# EAGLE design captester (EAGLE 5.06)
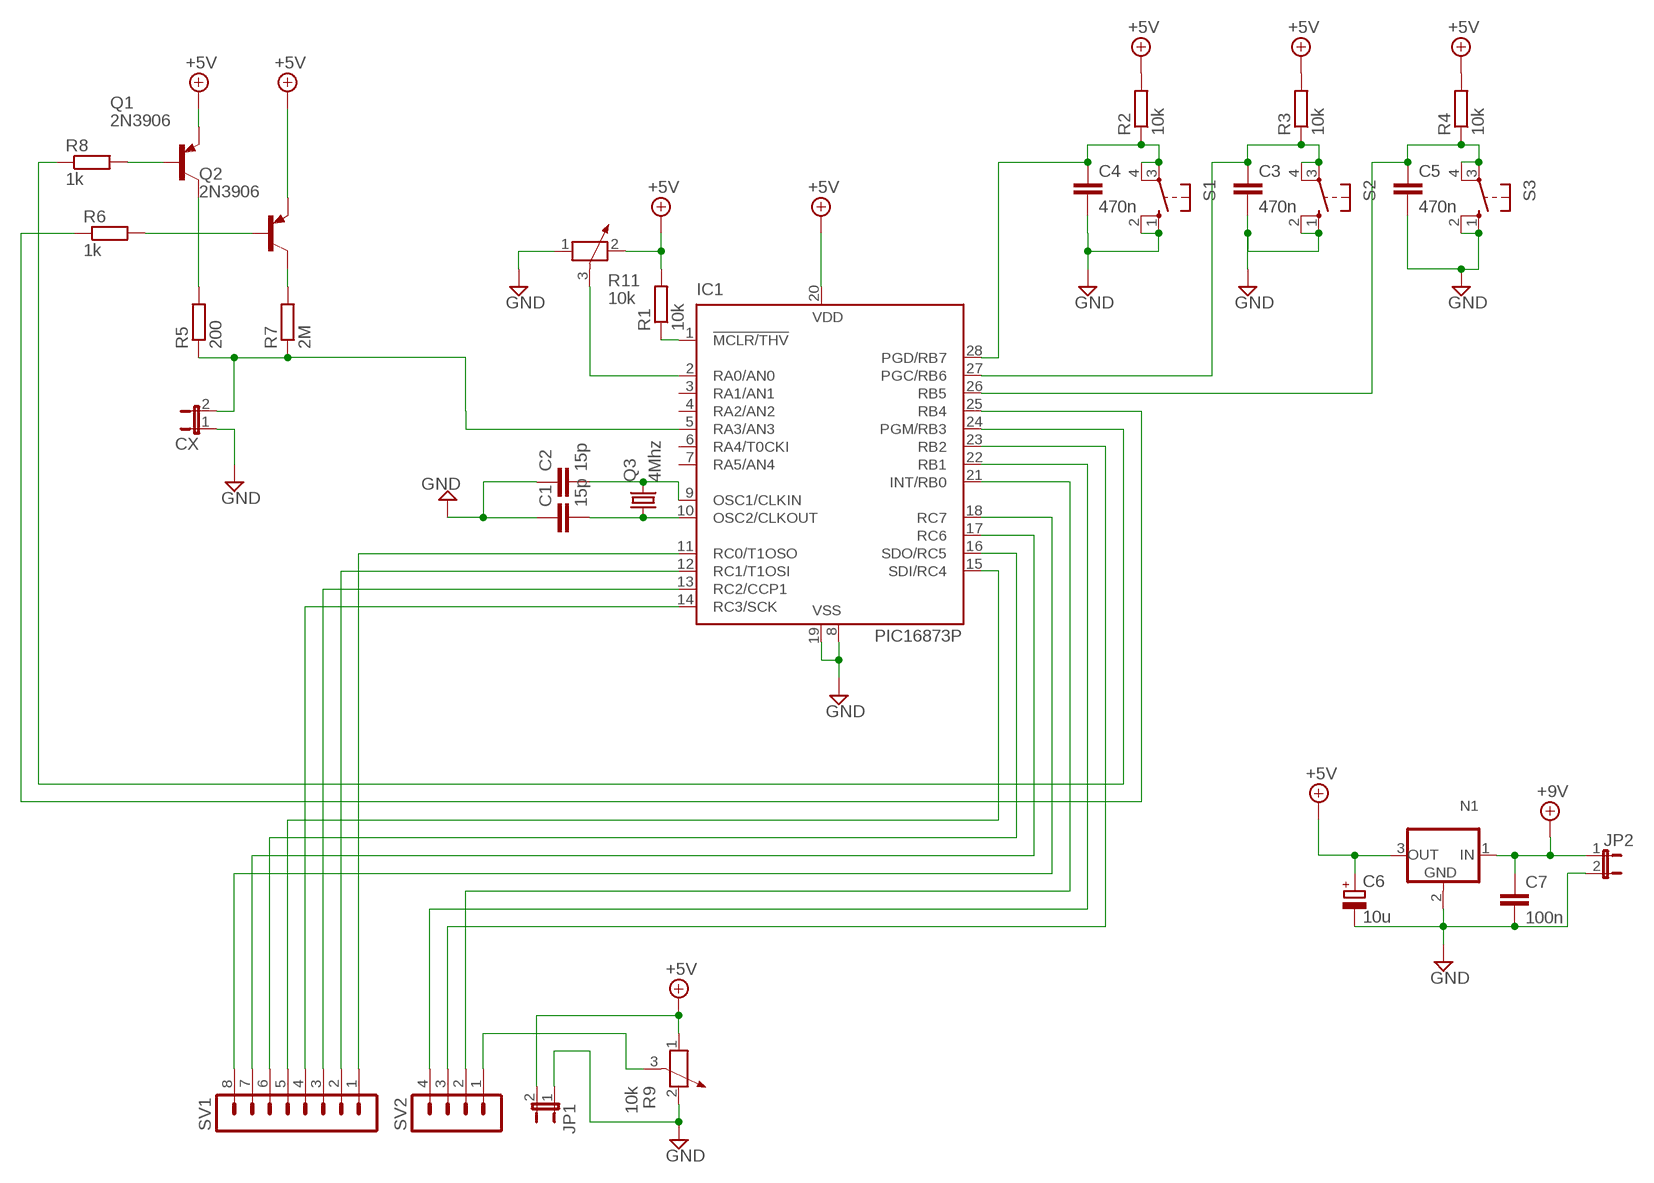
[diagram p0: schematic, sheet 1]

## Parts
C1  15p  C-EU025_050-025X075  [C025_050-025X075]
C2  15p  C-EU025_050-025X075  [C025_050-025X075]
C3  470n  C-EU025-025X050  [C025-025X050]
C4  470n  C-EU025-025X050  [C025-025X050]
C5  470n  C-EU025-025X050  [C025-025X050]
C6  10u  CPOL-EUE2.5-6  [E2,5-6]
C7  100n  C-EU025-025X050  [C025-025X050]
CX  JP1E  [JP1]
IC1  PIC16873P  [DIL28-3]
JP1  JP1E  [JP1]
JP2  JP1E  [JP1]
N1  7805  [TO220N]
Q1  2N3906  [TO92]
Q2  2N3906  [TO92]
Q3  4Mhz  CRYSTALHC49S  [HC49/S]
R1  10k  R-EU_0207/2V  [0207/2V]
R2  10k  R-EU_0207/2V  [0207/2V]
R3  10k  R-EU_0207/5V  [0207/5V]
R4  10k  R-EU_0207/2V  [0207/2V]
R5  200  R-EU_0207/2V  [0207/2V]
R6  1k  R-EU_0204/7  [0204/7]
R7  2M  R-EU_0207/2V  [0207/2V]
R8  1k  R-EU_0204/7  [0204/7]
R9  10k  POTENTIOMETER_PT-10S  [PT-10S]
R11  10k  POTENTIOMETER_PT-10S  [PT-10S]
S1  10-XX  [B3F-10XX]
S2  10-XX  [B3F-10XX]
S3  10-XX  [B3F-10XX]
SV1  MA08-1  [MA08-1]
SV2  MA04-1  [MA04-1]

## Nets
+5V: C6.+ IC1.20(VDD) JP1.2 N1.3(OUT) Q1.3(E) Q2.3(E) R1.2 R2.2 R3.2 R4.2 R9.1 R11.2
+9V: C7.1 JP2.1 N1.1(IN)
GND: C1.1 C2.1 C3.2 C4.2 C5.2 C6.- C7.2 CX.1 IC1.8(VSS) IC1.19(VSS) JP1.1 JP2.2 N1.2(GND) R9.2 R11.1 S1.1(S) S1.2(S1) S2.1(S) S2.2(S1) S3.1(S) S3.2(S1)
N$1: C4.1 IC1.28(PGD/RB7) R2.1 S1.3(P) S1.4(P1)
N$2: C3.1 IC1.27(PGC/RB6) R3.1 S2.3(P) S2.4(P1)
N$3: IC1.1(!MCLR/THV) R1.1
N$4: IC1.2(RA0/AN0) R11.3
N$5: C5.1 IC1.26(RB5) R4.1 S3.3(P) S3.4(P1)
N$6: R9.3 SV2.1
N$7: C2.2 IC1.9(OSC1/CLKIN) Q3.2
N$8: C1.2 IC1.10(OSC2/CLKOUT) Q3.1
N$9: Q2.2(B) R6.2
N$10: Q1.2(B) R8.2
N$11: Q2.1(C) R7.2
N$12: Q1.1(C) R5.2
N$13: CX.2 IC1.5(RA3/AN3) R5.1 R7.1
N$14: IC1.11(RC0/T1OSO) SV1.1
N$15: IC1.12(RC1/T1OSI) SV1.2
N$16: IC1.13(RC2/CCP1) SV1.3
N$17: IC1.14(RC3/SCK) SV1.4
N$18: IC1.15(SDI/RC4) SV1.5
N$19: IC1.16(SDO/RC5) SV1.6
N$20: IC1.17(RC6) SV1.7
N$21: IC1.18(RC7) SV1.8
N$22: IC1.21(INT/RB0) SV2.2
N$23: IC1.22(RB1) SV2.4
N$24: IC1.23(RB2) SV2.3
N$25: IC1.25(RB4) R6.1
N$26: IC1.24(PGM/RB3) R8.1
Unconnected: IC1.3(RA1/AN1) IC1.4(RA2/AN2) IC1.6(RA4/T0CKI) IC1.7(RA5/AN4)

## Library data of the parts
C1-C5 C7 = rcl:C-EU: CAPACITOR, European symbol
C6 = rcl:CPOL-EU: POLARIZED CAPACITOR, European symbol
CX JP1 JP2 = jumper:JP1E: JUMPER
IC1 = microchip:PIC16*873: MICROCONTROLLER flash type
N1 = ic:78*: 78xx: Fixed positive voltage regulator Voltage can be selected with change technology
Q1 Q2 = transistor-pnp:2N3906: PNP Transistor
Q3 = crystal:CRYSTAL: CRYSTAL
R1-R8 = rcl:R-EU_: RESISTOR, European symbol
R9 R11 = rcl:POTENTIOMETER_: Potentiometer
S1-S3 = switch-omron:10-XX: OMRON SWITCH
SV1 = con-lstb:MA08-1: PIN HEADER
SV2 = con-lstb:MA04-1: PIN HEADER

## Board
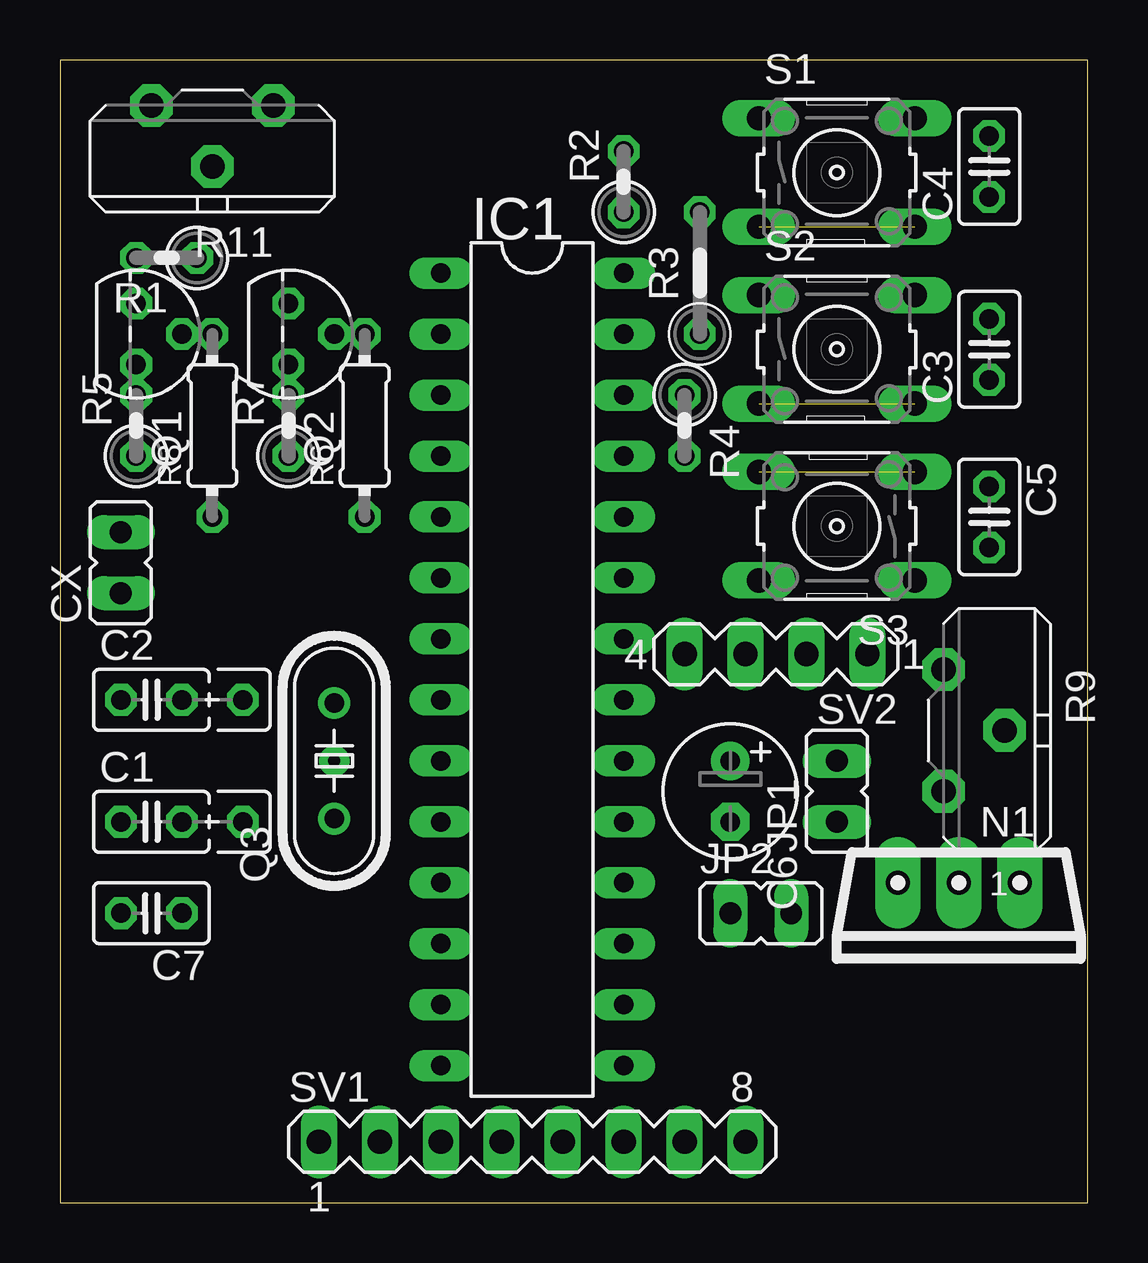
[diagram p1: board, top side]
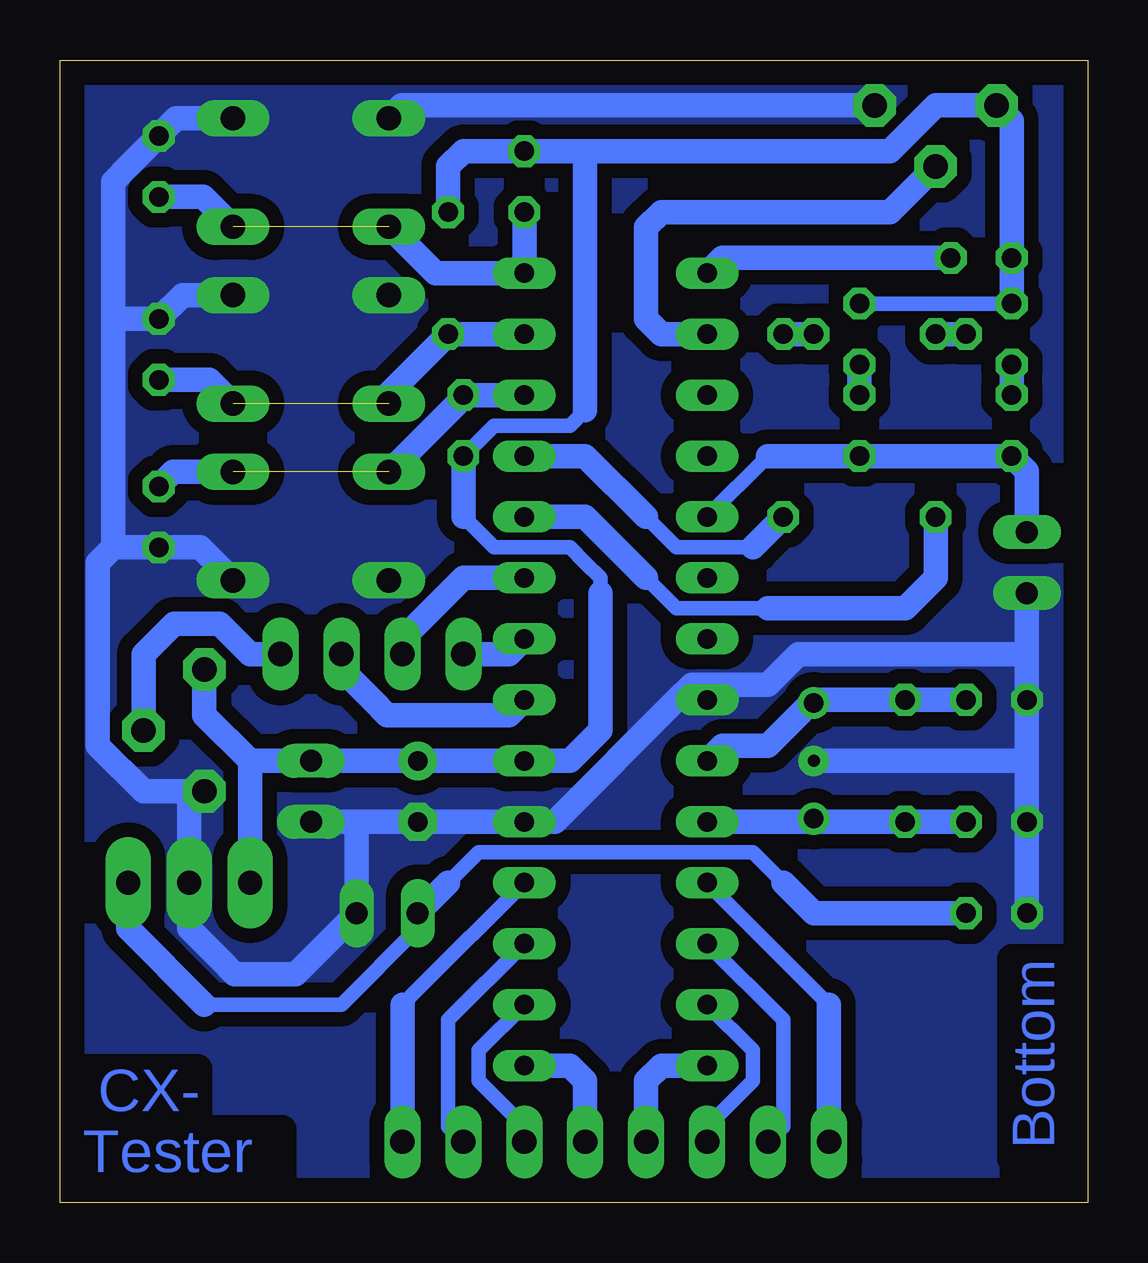
[diagram p2: board, bottom side, seen from below]

Size 42.85 x 47.62 mm. Coordinates in mm from the lower left corner, seen from the top.
Outline: 0,0 42.85,0 42.85,47.62 0,47.62 0,0
Copper layers (1*16): Top 0.035mm / dielectric 1.5mm / Bottom 0.035mm
Design rules "default": minimum track width 10mil, minimum drill 24mil, track to track 8mil, track to pad 8mil, pad to pad 8mil, via to via 8mil, smd to smd 8mil, copper to edge 40mil, drill to drill 8mil, minimum pad ring 10mil, minimum via ring 8mil, stop-mask expansion 4mil, vias tented up to drill 0mil, thermal gap 10mil

### Footprints (pad centres in the part's own frame; a part is rotated, then mirrored left to right if it is on the bottom)
C025_050-025X075 = drill 0.813 octagon: 1 -1.27,0; 2 1.27,0; 3 3.81,0
C025-025X050 = drill 0.813 octagon: 1 -1.27,0; 2 1.27,0
E2,5-6 = drill 0.813 pad 1.6 round: + -1.27,0 | drill 0.813 pad 1.6 octagon: - 1.27,0
JP1 = drill 0.914 long: 1 0,-1.27; 2 0,1.27
DIL28-3 = drill 0.813 long: 1 -16.51,-3.81; 2 -13.97,-3.81; 3 -11.43,-3.81; 4 -8.89,-3.81; 5 -6.35,-3.81; 6 -3.81,-3.81; 7 -1.27,-3.81; 8 1.27,-3.81; 9 3.81,-3.81; 10 6.35,-3.81; 11 8.89,-3.81; 12 11.43,-3.81; 13 13.97,-3.81; 14 16.51,-3.81; 15 16.51,3.81; 16 13.97,3.81; 17 11.43,3.81; 18 8.89,3.81; 19 6.35,3.81; 20 3.81,3.81; 21 1.27,3.81; 22 -1.27,3.81; 23 -3.81,3.81; 24 -6.35,3.81; 25 -8.89,3.81; 26 -11.43,3.81; 27 -13.97,3.81; 28 -16.51,3.81
TO220N = drill 0.991 pad 1.905 long: 1 -2.54,0; 2 0,0; 3 2.54,0
TO92 = drill 0.813 octagon: 1 1.27,0; 2 0,1.905; 3 -1.27,0
HC49/S = drill 0.813 round: 1 -2.413,0; 2 2.413,0
0207/2V = drill 0.813 octagon: 1 -1.27,0; 2 1.27,0
0207/5V = drill 0.813 octagon: 1 -2.54,0; 2 2.54,0
0204/7 = drill 0.813 octagon: 1 -3.81,0; 2 3.81,0
PT-10S = drill 1.016 pad 1.778 octagon: 1 -2.54,-1.27; 2 2.54,-1.27; 3 0,1.27
B3F-10XX = drill 1.016 long: 1 -3.251,2.261; 2 3.251,2.261; 3 -3.251,-2.261; 4 3.251,-2.261
MA08-1 = drill 1.016 long: 1 -8.89,0; 2 -6.35,0; 3 -3.81,0; 4 -1.27,0; 5 1.27,0; 6 3.81,0; 7 6.35,0; 8 8.89,0
MA04-1 = drill 1.016 long: 1 -3.81,0; 2 -1.27,0; 3 1.27,0; 4 3.81,0

### Placement (x,y rotation side)
C1  3.81,15.88 0 top
C2  3.81,20.95 0 top
C3  38.73,35.56 90 top
C4  38.73,43.18 90 top
C5  38.73,28.57 270 top
C6  27.94,17.14 270 top
C7  3.81,12.06 180 top
CX  2.54,26.67 0 top
IC1  19.68,22.23 270 top
JP1  32.38,17.14 0 top
JP2  29.21,12.06 270 top
N1  37.47,13.34 180 top
Q1  3.17,36.2 270 top
Q2  9.53,36.2 270 top
Q3  11.43,18.41 90 top
R1  4.45,39.37 180 top
R2  23.5,42.55 90 top
R3  26.67,38.73 90 top
R4  26.04,32.38 270 top
R5  3.17,32.38 90 top
R6  12.7,32.38 90 top
R7  9.53,32.38 90 top
R8  6.35,32.38 90 top
R9  38.1,19.68 270 top
R11  6.35,44.45 180 top
S1  32.38,42.93 0 top
S2  32.38,35.56 0 top
S3  32.38,28.19 180 top
SV1  19.68,2.54 0 top
SV2  29.84,22.86 180 top

### Tracks (layer width: path | path; a pad name or v marks a point on that pad's centre or on a via)
+5V
  Bottom 0.406: JP1.2 34.29,18.41
  Bottom 0.61: 20.95,33.02 21.59,32.38 24.77,32.38 R4.2 | 21.59,18.41 IC1.20 | 26.04,28.57 24.77,27.3 21.59,27.3 20.95,26.67 20.32,26.04 20.32,25.4 | Q1.3 Q2.3
  Bottom 1.016: 3.17,45.09 R11.2 | 3.17,45.09 R1.2 Q1.3 3.17,45.09 | 3.17,45.09 R11.2 | R11.2 6.35,45.72 8.26,43.81 11.43,43.81 | 26.67,43.18 R3.2 26.67,43.18 | 26.04,43.81 26.67,43.18 | 26.04,43.81 R2.2 20.95,43.81 | 11.43,43.81 10.79,43.81 | 11.43,43.81 20.95,43.81 | 26.04,43.81 26.67,43.18 | 20.95,43.81 26.04,43.81 | 20.95,43.81 20.95,33.02 | R4.2 26.04,28.57 | R9.1 36.83,20.95 36.83,20.32 34.92,18.41 | 34.92,18.41 34.29,18.41 JP1.2 C6.+ IC1.20 21.59,18.41 | 34.92,18.41 N1.3 | 20.95,19.05 21.59,18.41 | 20.95,19.05 21.59,18.41 | 20.95,19.05 20.32,19.68 20.32,25.4
+9V
  Bottom 0.61: 36.83,8.26 36.2,8.26 31.75,8.26 31.11,8.26 27.94,11.43 JP2.1 | 12.7,13.34 13.97,14.61 24.77,14.61 25.4,14.61 26.67,13.34
  Bottom 1.016: C7.1 11.43,12.06 12.7,13.34 | 36.83,8.26 40.01,11.43 N1.1 | 26.67,13.34 JP2.1
GND  (via drill 0.5 pad 1.27)
  Bottom 1.016: 2.54,18.41 C1.1 C7.2 | 2.54,18.41 C2.1 2.54,22.23 2.54,22.86 | 2.54,18.41 v11.43,18.41 | S1.2 38,45.19 C4.2 40.01,43.18 40.64,42.55 40.64,36.83 | R11.1 28.6,45.72 S1.1 | 40.64,36.83 40.64,31.75 40.64,29.21 40.64,27.3 | S2.2 37.74,37.82 C3.2 40.64,36.83 | 40.64,27.3 C5.2 37.01,27.3 S3.1 | 37.47,17.14 R9.2 | 37.47,17.14 39.37,17.14 41.27,19.05 41.27,26.67 40.64,27.3 | 37.47,17.14 N1.2 37.47,11.43 36.2,10.16 35.56,9.53 33.02,9.53 32.38,10.16 JP2.2 30.48,15.88 | 30.48,15.88 C6.- IC1.19 22.23,15.88 17.14,20.95 16.51,21.59 | 30.48,15.88 JP1.1 30.48,15.88 | 15.88,21.59 14.61,21.59 13.34,21.59 12.06,22.86 3.17,22.86 2.54,22.86 | 15.88,21.59 16.51,21.59 | 15.88,21.59 16.51,21.59 | 15.88,21.59 IC1.8 | 2.54,22.86 CX.1
  pour Bottom (isolate 0.61, no thermals): 0.64,46.99 42.55,46.99 42.55,0.64 0.64,0.64
N$1  (1 unrouted)
  Bottom 1.016: S1.3 27.2,38.73 IC1.28 R2.1 | S1.4 36.88,41.91 C4.1
N$2  (1 unrouted)
  Bottom 1.016: IC1.27 R3.1 29.13,33.73 S2.3 | S2.4 36.63,34.29 C3.1
N$3
  Bottom 1.016: R1.1 15.24,39.37 IC1.1
N$4
  Bottom 1.016: R11.3 8.26,41.27 16.51,41.27 17.14,41.27 17.78,41.27 18.41,40.64 18.41,39.37 18.41,37.47 18.41,36.83 17.78,36.2 IC1.2
N$5  (1 unrouted)
  Bottom 1.016: IC1.26 R4.1 26.04,33.55 S3.4 | S3.3 38.12,30.45 C5.1
N$6
  Bottom 1.016: SV2.1 34.92,22.86 36.2,24.13 37.47,24.13 38.1,24.13 39.37,22.86 R9.3
N$7
  Bottom 1.016: IC1.9 15.24,19.05 13.34,19.05 11.56,20.83 Q3.2 11.3,20.95 C2.2
N$8
  Bottom 1.016: C1.2 11.43,15.88 | 11.43,15.88 IC1.10 | 11.43,15.88 Q3.1
N$9
  Bottom 1.016: Q2.2 R6.2
N$10
  Bottom 1.016: R8.2 Q1.2
N$11
  Bottom 1.016: R7.2 Q2.1
N$12
  Bottom 1.016: R5.2 Q1.1
N$13
  Bottom 0.61: 13.34,31.11 IC1.5
  Bottom 1.016: 13.34,31.11 R7.1 R5.1 2.54,30.48 CX.2
N$14
  Bottom 0.61: 10.79,8.26 IC1.11
  Bottom 1.016: SV1.1 10.79,8.26
N$15
  Bottom 0.61: IC1.12 12.7,7.62 12.7,3.17 SV1.2
N$16
  Bottom 0.61: IC1.13 13.97,6.35 13.97,5.08 15.88,3.17
  Bottom 1.016: SV1.3 15.88,3.17
N$17
  Bottom 1.016: IC1.14 17.78,5.71 18.41,5.08 SV1.4
N$18
  Bottom 1.016: SV1.5 20.95,5.08 21.59,5.71 IC1.15
N$19
  Bottom 0.61: IC1.16 25.4,6.35 25.4,5.08 24.13,3.81 23.5,3.17
  Bottom 1.016: SV1.6 23.5,3.17
N$20
  Bottom 0.61: IC1.17 26.67,7.62 26.67,3.17 SV1.7
N$21
  Bottom 0.61: IC1.18 27.94,8.89 28.57,8.26
  Bottom 1.016: SV1.8 28.57,8.26
N$22
  Bottom 1.016: SV2.2 31.11,22.23 29.84,20.95 29.21,20.32 24.13,20.32 IC1.21
N$23
  Bottom 1.016: IC1.22 24.13,22.86 SV2.4
N$24
  Bottom 1.016: SV2.3 28.57,23.5 27.3,24.77 26.67,25.4 26.04,26.04 IC1.23
N$25
  Bottom 0.61: 13.97,27.3 17.14,27.3 17.78,27.94 18.41,28.57
  Bottom 1.016: 18.41,28.57 20.95,31.11 IC1.25 | 13.97,27.3 R6.1
N$26
  Bottom 0.61: 13.34,24.77 17.14,24.77 18.41,26.04
  Bottom 1.016: R8.1 6.35,26.04 7.62,24.77 12.06,24.77 13.34,24.77 | IC1.24 20.95,28.57 18.41,26.04

### Text on the board
Bottom: Bottom | CX- | Tester